# Altium schematic sheet Sheet5.SchDoc: =GlobalProjectName
size 209 x 297 mm; ApprovedBy: Утвердил; CheckedBy: Проверил; Author: Разработал; SheetNumber: 54; SheetTotal: 66; PageSetup: Record=PageOptions|CenterHorizontal=True|CenterVertical=True|PrintScale=1.00|XCorrection=1.00|YCorrection=1.00|PrintKind=1|BorderSize=5000000|LeftOffset=0|BottomOffset=0|Orientation=2|PaperLength=1000|PaperWidth=1000|Scale=100|PaperSource=15|PrintQuality=1200|MediaType=1|DitherType=10|PaperKind=A3|PrintScaleMode=1; Weight: -; ScaleFactor: -; NormInspection: Норм.Контр.
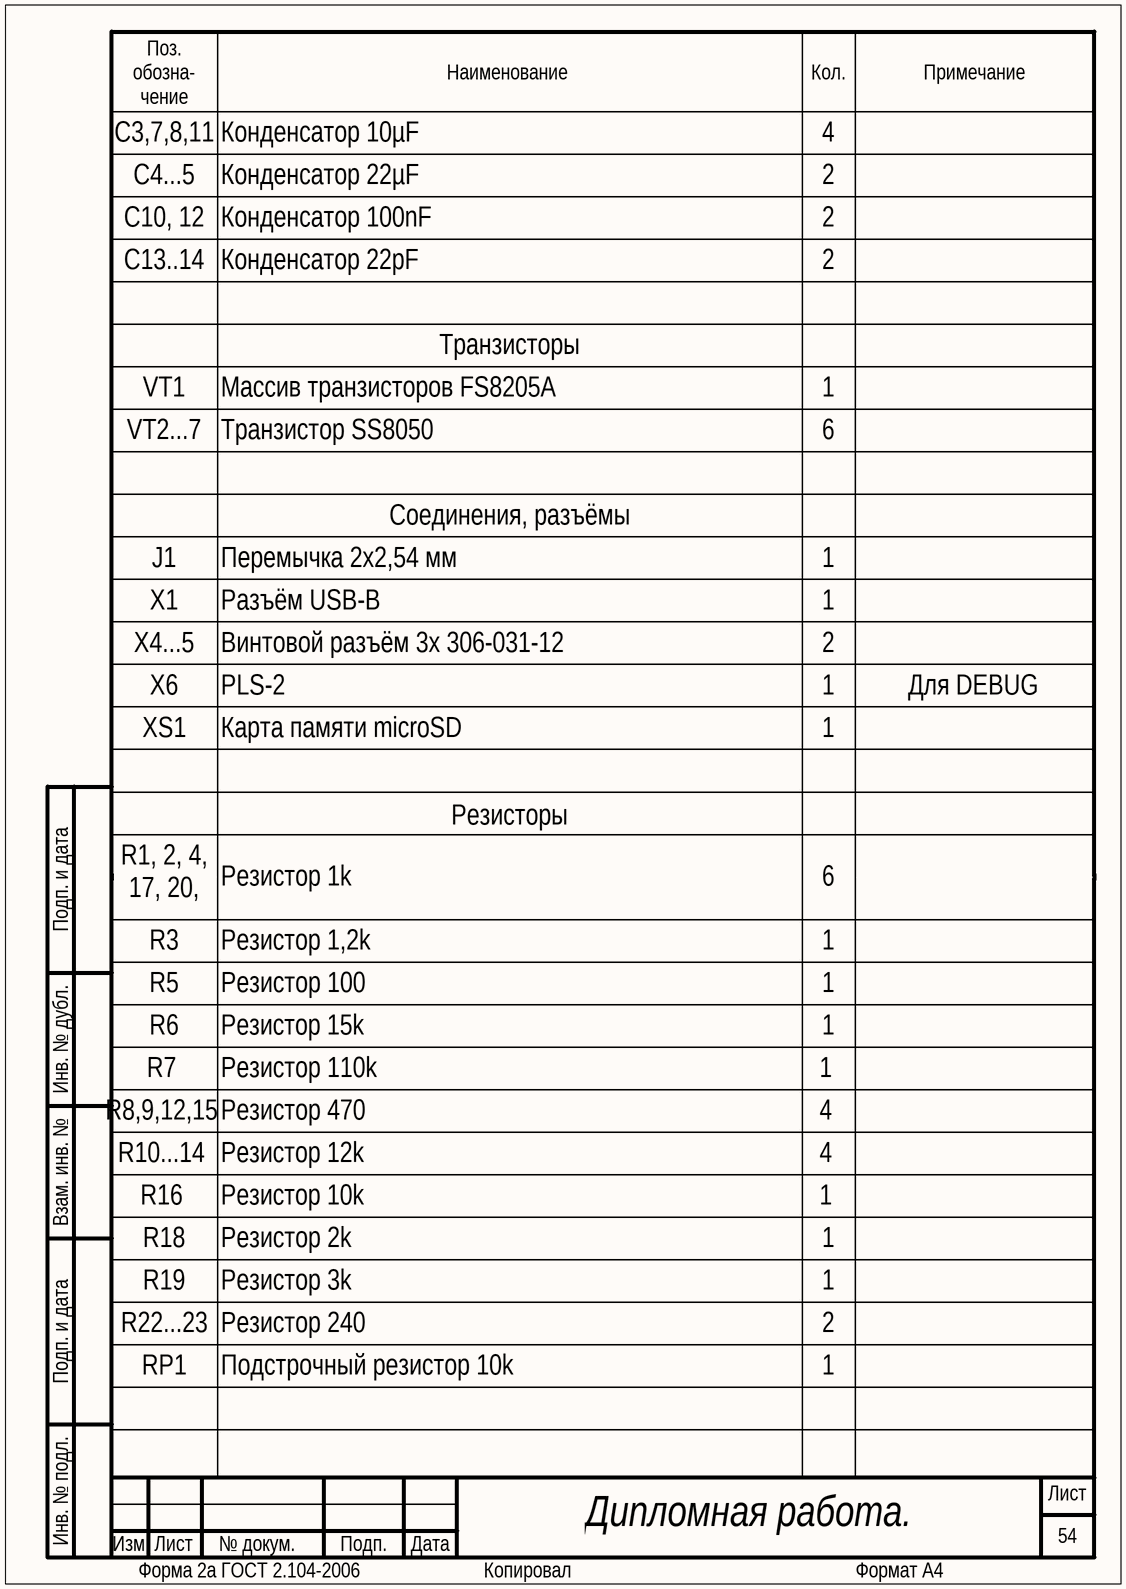
[diagram p0: Sheet5.SchDoc]

## Notes on the sheet
- С4...5
- С3,7,8,11
- Конденсатор 22µF
- Конденсатор 10µF
- 2
- 4
- С10, 12
- Конденсатор 100nF
- С13..14
- Конденсатор 22pF
- Транзисторы
- VT1
- VT2...7
- Массив транзисторов FS8205A
- Транзистор SS8050
- 1
- 6
- Соединения, разъёмы
- J1
- Перемычка 2x2,54 мм
- X1
- X4...5
- Разъём USB-B
- Винтовой разъём 3x 306-031-12
- X6
- PLS-2
- Для DEBUG
- XS1
- Карта памяти microSD
- Резисторы
- R1, 2, 4,  17, 20, 21
- Резистор 1k
- R3
- R5
- Резистор 1,2k
- Резистор 100
- R6
- Резистор 15k
- R7
- R8,9,12,15
- Резистор 110k
- Резистор 470
- R10...14
- Резистор 12k
- R16
- R18
- Резистор 10k
- Резистор 2k
- R19
- R22...23
- Резистор 3k
- Резистор 240
- RP1
- Подстрочный резистор 10k
- Дипломная работа.
- Поз.
  обозна-
  чение
- Наименование
- Кол.
- Примечание
- Подп. и дата
- Инв. № дубл.
- Взам. инв. №
- Инв. № подл.
- Изм.
- Лист
- № докум.
- Подп.
- Дата
- Форма 2а ГОСТ 2.104-2006
- Копировал
- Формат А4